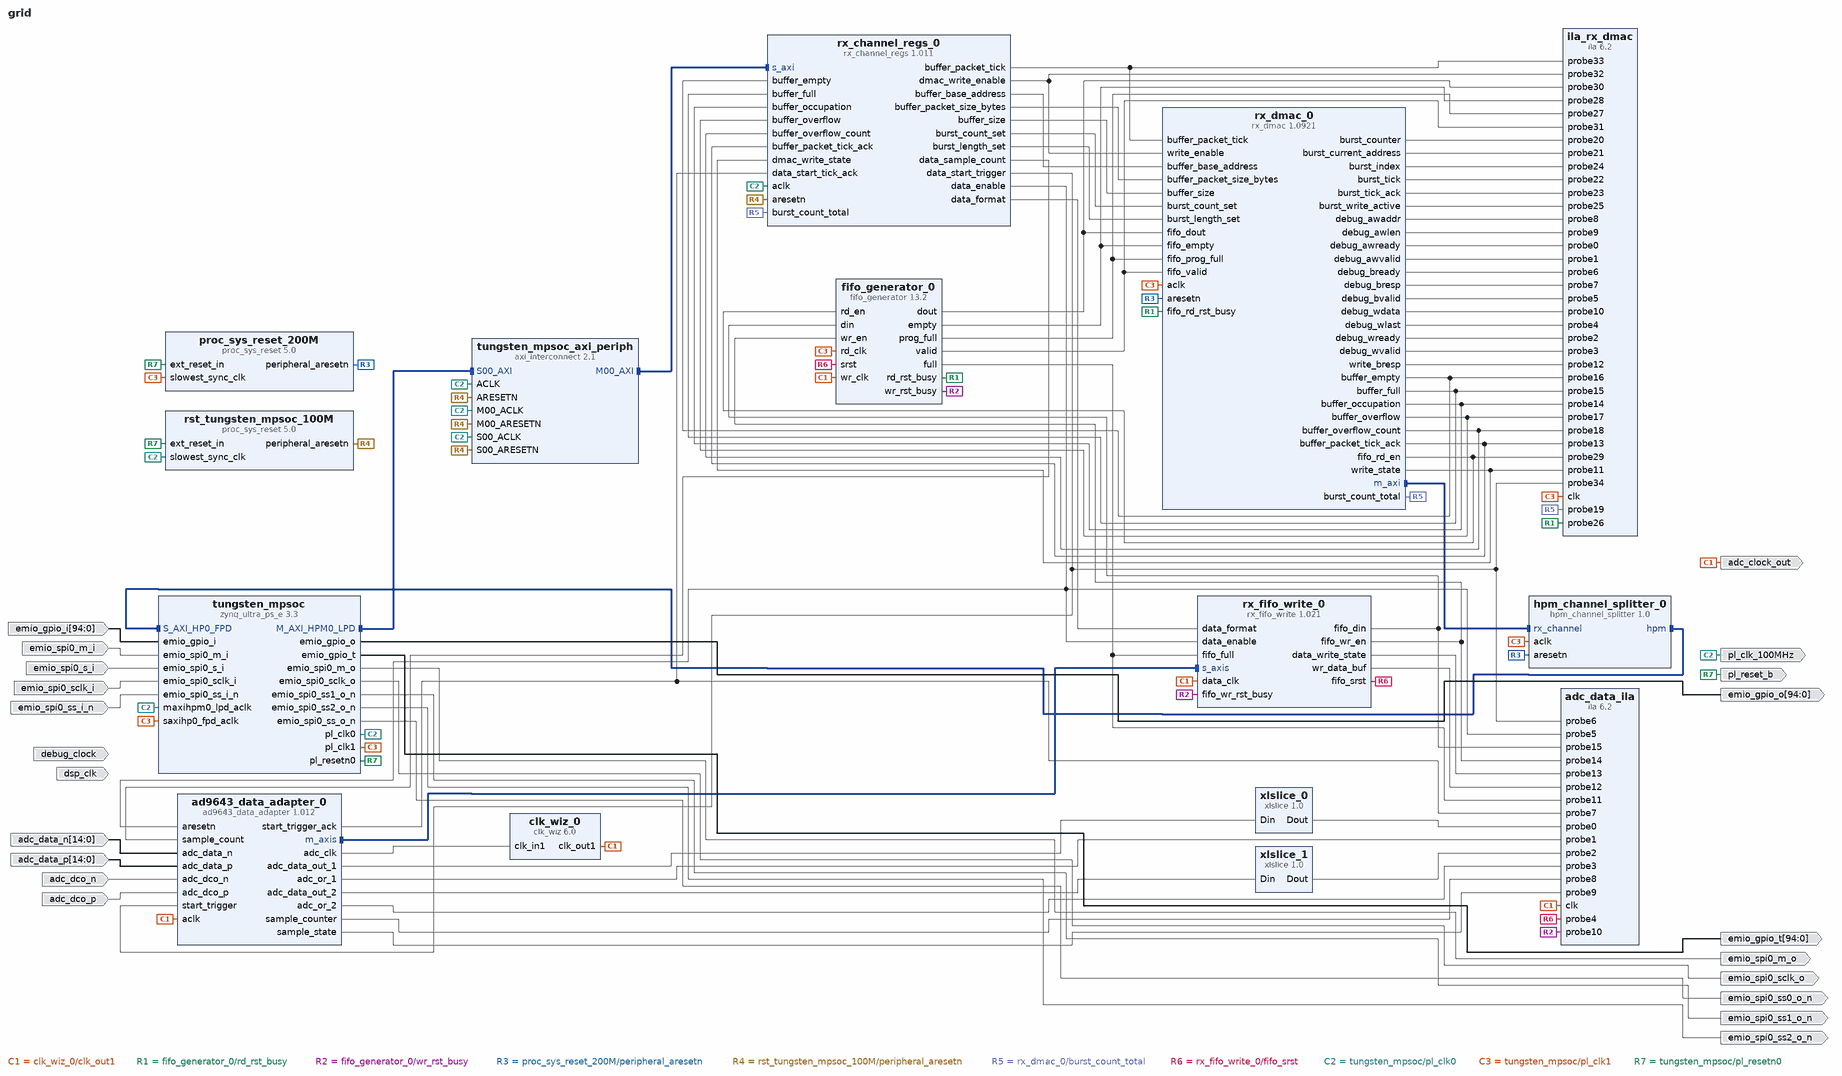
[diagram p0: block diagram of the top level]
# Vivado block design grid, xczu3cg-sfvc784-1-e, Vivado 2021.1.1
create_bd_design grid

create_bd_port -dir O -type rst pl_reset_b
create_bd_port -dir O -type clk pl_clk_100MHz
create_bd_port -dir O emio_spi0_sclk_o
create_bd_port -dir O emio_spi0_m_o
create_bd_port -dir I emio_spi0_m_i
create_bd_port -dir O emio_spi0_ss0_o_n
create_bd_port -dir O emio_spi0_ss1_o_n
create_bd_port -dir O emio_spi0_ss2_o_n
create_bd_port -dir I -from 94 -to 0 emio_gpio_i
create_bd_port -dir O -from 94 -to 0 emio_gpio_o
create_bd_port -dir O -from 94 -to 0 emio_gpio_t
create_bd_port -dir I debug_clock
create_bd_port -dir I emio_spi0_sclk_i
create_bd_port -dir I emio_spi0_ss_i_n
create_bd_port -dir I emio_spi0_s_i
create_bd_port -dir I -type clk dsp_clk
set_property -dict {CONFIG.FREQ_HZ 250000000} [get_bd_ports dsp_clk]
create_bd_port -dir I adc_dco_p
create_bd_port -dir I adc_dco_n
create_bd_port -dir I -from 14 -to 0 adc_data_p
create_bd_port -dir I -from 14 -to 0 adc_data_n
create_bd_port -dir O -type clk adc_clock_out

create_bd_cell -type ip -vlnv xilinx.com:ip:zynq_ultra_ps_e:3.3 tungsten_mpsoc
set_property -dict [list \
  CONFIG.CAN0_BOARD_INTERFACE custom \
  CONFIG.CAN1_BOARD_INTERFACE custom \
  CONFIG.CSU_BOARD_INTERFACE custom \
  CONFIG.DP_BOARD_INTERFACE custom \
  CONFIG.GEM0_BOARD_INTERFACE custom \
  CONFIG.GEM1_BOARD_INTERFACE custom \
  CONFIG.GEM2_BOARD_INTERFACE custom \
  CONFIG.GEM3_BOARD_INTERFACE custom \
  CONFIG.GPIO_BOARD_INTERFACE custom \
  CONFIG.IIC0_BOARD_INTERFACE custom \
  CONFIG.IIC1_BOARD_INTERFACE custom \
  CONFIG.NAND_BOARD_INTERFACE custom \
  CONFIG.PCIE_BOARD_INTERFACE custom \
  CONFIG.PJTAG_BOARD_INTERFACE custom \
  CONFIG.PMU_BOARD_INTERFACE custom \
  CONFIG.PSU_BANK_0_IO_STANDARD LVCMOS33 \
  CONFIG.PSU_BANK_1_IO_STANDARD LVCMOS33 \
  CONFIG.PSU_BANK_2_IO_STANDARD LVCMOS33 \
  CONFIG.PSU_BANK_3_IO_STANDARD LVCMOS33 \
  CONFIG.PSU_USB3__DUAL_CLOCK_ENABLE 1 \
  CONFIG.PSU__ACPU2__POWER__ON 0 \
  CONFIG.PSU__ACPU3__POWER__ON 0 \
  CONFIG.PSU__CAN1__PERIPHERAL__ENABLE 0 \
  CONFIG.PSU__CRF_APB__ACPU_CTRL__FREQMHZ 1200 \
  CONFIG.PSU__CRF_APB__ACPU_CTRL__SRCSEL APLL \
  CONFIG.PSU__CRF_APB__APLL_CTRL__SRCSEL PSS_REF_CLK \
  CONFIG.PSU__CRF_APB__DBG_FPD_CTRL__FREQMHZ 250 \
  CONFIG.PSU__CRF_APB__DBG_FPD_CTRL__SRCSEL IOPLL \
  CONFIG.PSU__CRF_APB__DBG_TRACE_CTRL__FREQMHZ 250 \
  CONFIG.PSU__CRF_APB__DBG_TRACE_CTRL__SRCSEL IOPLL \
  CONFIG.PSU__CRF_APB__DBG_TSTMP_CTRL__FREQMHZ 250 \
  CONFIG.PSU__CRF_APB__DBG_TSTMP_CTRL__SRCSEL IOPLL \
  CONFIG.PSU__CRF_APB__DDR_CTRL__FREQMHZ 1200 \
  CONFIG.PSU__CRF_APB__DDR_CTRL__SRCSEL DPLL \
  CONFIG.PSU__CRF_APB__DPDMA_REF_CTRL__FREQMHZ 600 \
  CONFIG.PSU__CRF_APB__DPDMA_REF_CTRL__SRCSEL DPLL \
  CONFIG.PSU__CRF_APB__DPLL_CTRL__SRCSEL PSS_REF_CLK \
  CONFIG.PSU__CRF_APB__DP_AUDIO_REF_CTRL__SRCSEL VPLL \
  CONFIG.PSU__CRF_APB__DP_STC_REF_CTRL__SRCSEL VPLL \
  CONFIG.PSU__CRF_APB__DP_VIDEO_REF_CTRL__SRCSEL DPLL \
  CONFIG.PSU__CRF_APB__GDMA_REF_CTRL__FREQMHZ 600 \
  CONFIG.PSU__CRF_APB__GDMA_REF_CTRL__SRCSEL DPLL \
  CONFIG.PSU__CRF_APB__GPU_REF_CTRL__FREQMHZ 600 \
  CONFIG.PSU__CRF_APB__GPU_REF_CTRL__SRCSEL DPLL \
  CONFIG.PSU__CRF_APB__TOPSW_LSBUS_CTRL__FREQMHZ 100 \
  CONFIG.PSU__CRF_APB__TOPSW_LSBUS_CTRL__SRCSEL IOPLL \
  CONFIG.PSU__CRF_APB__TOPSW_MAIN_CTRL__FREQMHZ 533.333 \
  CONFIG.PSU__CRF_APB__TOPSW_MAIN_CTRL__SRCSEL VPLL \
  CONFIG.PSU__CRF_APB__VPLL_CTRL__SRCSEL PSS_REF_CLK \
  CONFIG.PSU__CRL_APB__ADMA_REF_CTRL__FREQMHZ 500 \
  CONFIG.PSU__CRL_APB__ADMA_REF_CTRL__SRCSEL IOPLL \
  CONFIG.PSU__CRL_APB__CAN1_REF_CTRL__FREQMHZ 100 \
  CONFIG.PSU__CRL_APB__CAN1_REF_CTRL__SRCSEL IOPLL \
  CONFIG.PSU__CRL_APB__CPU_R5_CTRL__FREQMHZ 500 \
  CONFIG.PSU__CRL_APB__CPU_R5_CTRL__SRCSEL IOPLL \
  CONFIG.PSU__CRL_APB__DBG_LPD_CTRL__FREQMHZ 250 \
  CONFIG.PSU__CRL_APB__DBG_LPD_CTRL__SRCSEL IOPLL \
  CONFIG.PSU__CRL_APB__GEM3_REF_CTRL__FREQMHZ 125 \
  CONFIG.PSU__CRL_APB__GEM3_REF_CTRL__SRCSEL IOPLL \
  CONFIG.PSU__CRL_APB__I2C0_REF_CTRL__FREQMHZ 100 \
  CONFIG.PSU__CRL_APB__I2C0_REF_CTRL__SRCSEL IOPLL \
  CONFIG.PSU__CRL_APB__I2C1_REF_CTRL__FREQMHZ 100 \
  CONFIG.PSU__CRL_APB__I2C1_REF_CTRL__SRCSEL IOPLL \
  CONFIG.PSU__CRL_APB__IOPLL_CTRL__SRCSEL PSS_REF_CLK \
  CONFIG.PSU__CRL_APB__IOU_SWITCH_CTRL__FREQMHZ 267 \
  CONFIG.PSU__CRL_APB__IOU_SWITCH_CTRL__SRCSEL RPLL \
  CONFIG.PSU__CRL_APB__LPD_LSBUS_CTRL__FREQMHZ 100 \
  CONFIG.PSU__CRL_APB__LPD_LSBUS_CTRL__SRCSEL IOPLL \
  CONFIG.PSU__CRL_APB__LPD_SWITCH_CTRL__FREQMHZ 500 \
  CONFIG.PSU__CRL_APB__LPD_SWITCH_CTRL__SRCSEL IOPLL \
  CONFIG.PSU__CRL_APB__PCAP_CTRL__FREQMHZ 200 \
  CONFIG.PSU__CRL_APB__PCAP_CTRL__SRCSEL IOPLL \
  CONFIG.PSU__CRL_APB__PL0_REF_CTRL__FREQMHZ 100 \
  CONFIG.PSU__CRL_APB__PL0_REF_CTRL__SRCSEL RPLL \
  CONFIG.PSU__CRL_APB__PL1_REF_CTRL__FREQMHZ 200 \
  CONFIG.PSU__CRL_APB__PL1_REF_CTRL__SRCSEL DPLL \
  CONFIG.PSU__CRL_APB__QSPI_REF_CTRL__FREQMHZ 300 \
  CONFIG.PSU__CRL_APB__QSPI_REF_CTRL__SRCSEL IOPLL \
  CONFIG.PSU__CRL_APB__RPLL_CTRL__SRCSEL PSS_REF_CLK \
  CONFIG.PSU__CRL_APB__SDIO1_REF_CTRL__FREQMHZ 200 \
  CONFIG.PSU__CRL_APB__SDIO1_REF_CTRL__SRCSEL RPLL \
  CONFIG.PSU__CRL_APB__SPI0_REF_CTRL__FREQMHZ 150 \
  CONFIG.PSU__CRL_APB__SPI0_REF_CTRL__SRCSEL IOPLL \
  CONFIG.PSU__CRL_APB__SPI1_REF_CTRL__FREQMHZ 150 \
  CONFIG.PSU__CRL_APB__SPI1_REF_CTRL__SRCSEL IOPLL \
  CONFIG.PSU__CRL_APB__TIMESTAMP_REF_CTRL__FREQMHZ 100 \
  CONFIG.PSU__CRL_APB__TIMESTAMP_REF_CTRL__SRCSEL PSS_REF_CLK \
  CONFIG.PSU__CRL_APB__UART0_REF_CTRL__FREQMHZ 100 \
  CONFIG.PSU__CRL_APB__UART0_REF_CTRL__SRCSEL IOPLL \
  CONFIG.PSU__CRL_APB__UART1_REF_CTRL__FREQMHZ 100 \
  CONFIG.PSU__CRL_APB__UART1_REF_CTRL__SRCSEL IOPLL \
  CONFIG.PSU__CRL_APB__USB0_BUS_REF_CTRL__FREQMHZ 250 \
  CONFIG.PSU__CRL_APB__USB0_BUS_REF_CTRL__SRCSEL IOPLL \
  CONFIG.PSU__CRL_APB__USB3_DUAL_REF_CTRL__FREQMHZ 20 \
  CONFIG.PSU__CRL_APB__USB3_DUAL_REF_CTRL__SRCSEL IOPLL \
  CONFIG.PSU__CRL_APB__USB3__ENABLE 1 \
  CONFIG.PSU__CSUPMU__PERIPHERAL__VALID 0 \
  CONFIG.PSU__DDRC__BUS_WIDTH {64 Bit} \
  CONFIG.PSU__DDRC__COMPONENTS Components \
  CONFIG.PSU__DDRC__DEVICE_CAPACITY {8192 MBits} \
  CONFIG.PSU__DDRC__DRAM_WIDTH {16 Bits} \
  CONFIG.PSU__DDRC__ECC Disabled \
  CONFIG.PSU__DDRC__MEMORY_TYPE {DDR 4} \
  CONFIG.PSU__DDRC__SPEED_BIN DDR4_2400T \
  CONFIG.PSU__DDR_HIGH_ADDRESS_GUI_ENABLE 1 \
  CONFIG.PSU__DDR__INTERFACE__FREQMHZ 600.000 \
  CONFIG.PSU__DEVICE_TYPE CG \
  CONFIG.PSU__DISPLAYPORT__PERIPHERAL__ENABLE 0 \
  CONFIG.PSU__DLL__ISUSED 1 \
  CONFIG.PSU__ENET1__GRP_MDIO__ENABLE 1 \
  CONFIG.PSU__ENET1__GRP_MDIO__IO {MIO 50 .. 51} \
  CONFIG.PSU__ENET1__PERIPHERAL__ENABLE 1 \
  CONFIG.PSU__ENET1__PERIPHERAL__IO {GT Lane1} \
  CONFIG.PSU__ENET3__PERIPHERAL__ENABLE 0 \
  CONFIG.PSU__FPD_SLCR__WDT1__FREQMHZ 100 \
  CONFIG.PSU__FPGA_PL0_ENABLE 1 \
  CONFIG.PSU__FPGA_PL1_ENABLE 1 \
  CONFIG.PSU__GEM1__REF_CLK_FREQ 125 \
  CONFIG.PSU__GEM1__REF_CLK_SEL {Ref Clk1} \
  CONFIG.PSU__GEM__TSU__ENABLE 0 \
  CONFIG.PSU__GPIO0_MIO__IO {MIO 0 .. 25} \
  CONFIG.PSU__GPIO0_MIO__PERIPHERAL__ENABLE 1 \
  CONFIG.PSU__GPIO1_MIO__IO {MIO 26 .. 51} \
  CONFIG.PSU__GPIO1_MIO__PERIPHERAL__ENABLE 1 \
  CONFIG.PSU__GPIO_EMIO_WIDTH 95 \
  CONFIG.PSU__GPIO_EMIO__PERIPHERAL__ENABLE 1 \
  CONFIG.PSU__GPIO_EMIO__PERIPHERAL__IO 95 \
  CONFIG.PSU__GPU_PP0__POWER__ON 0 \
  CONFIG.PSU__GPU_PP1__POWER__ON 0 \
  CONFIG.PSU__I2C0__PERIPHERAL__ENABLE 1 \
  CONFIG.PSU__I2C0__PERIPHERAL__IO {MIO 6 .. 7} \
  CONFIG.PSU__I2C1__PERIPHERAL__ENABLE 1 \
  CONFIG.PSU__I2C1__PERIPHERAL__IO {MIO 44 .. 45} \
  CONFIG.PSU__IOU_SLCR__IOU_TTC_APB_CLK__TTC0_SEL APB \
  CONFIG.PSU__IOU_SLCR__IOU_TTC_APB_CLK__TTC1_SEL APB \
  CONFIG.PSU__IOU_SLCR__IOU_TTC_APB_CLK__TTC2_SEL APB \
  CONFIG.PSU__IOU_SLCR__IOU_TTC_APB_CLK__TTC3_SEL APB \
  CONFIG.PSU__IOU_SLCR__WDT0__FREQMHZ 100 \
  CONFIG.PSU__LPD_SLCR__CSUPMU__FREQMHZ 100 \
  CONFIG.PSU__OVERRIDE_HPX_QOS 0 \
  CONFIG.PSU__OVERRIDE__BASIC_CLOCK 0 \
  CONFIG.PSU__PJTAG__PERIPHERAL__ENABLE 1 \
  CONFIG.PSU__PJTAG__PERIPHERAL__IO {MIO 26 .. 29} \
  CONFIG.PSU__PMU__PERIPHERAL__ENABLE 0 \
  CONFIG.PSU__PRESET_APPLIED 0 \
  CONFIG.PSU__PSS_REF_CLK__FREQMHZ 50 \
  CONFIG.PSU__QSPI_COHERENCY 0 \
  CONFIG.PSU__QSPI_ROUTE_THROUGH_FPD 0 \
  CONFIG.PSU__QSPI__GRP_FBCLK__ENABLE 0 \
  CONFIG.PSU__QSPI__PERIPHERAL__DATA_MODE x4 \
  CONFIG.PSU__QSPI__PERIPHERAL__ENABLE 1 \
  CONFIG.PSU__QSPI__PERIPHERAL__IO {MIO 0 .. 5} \
  CONFIG.PSU__QSPI__PERIPHERAL__MODE Single \
  CONFIG.PSU__SATA__PERIPHERAL__ENABLE 0 \
  CONFIG.PSU__SD0__DATA_TRANSFER_MODE 4Bit \
  CONFIG.PSU__SD0__GRP_CD__ENABLE 1 \
  CONFIG.PSU__SD0__GRP_CD__IO {MIO 24} \
  CONFIG.PSU__SD0__PERIPHERAL__ENABLE 1 \
  CONFIG.PSU__SD0__PERIPHERAL__IO {MIO 13 .. 16 21 22} \
  CONFIG.PSU__SD0__SLOT_TYPE {SD 2.0} \
  CONFIG.PSU__SD1__PERIPHERAL__ENABLE 0 \
  CONFIG.PSU__SPI0__GRP_SS0__IO EMIO \
  CONFIG.PSU__SPI0__GRP_SS1__ENABLE 1 \
  CONFIG.PSU__SPI0__GRP_SS1__IO EMIO \
  CONFIG.PSU__SPI0__GRP_SS2__ENABLE 1 \
  CONFIG.PSU__SPI0__GRP_SS2__IO EMIO \
  CONFIG.PSU__SPI0__PERIPHERAL__ENABLE 1 \
  CONFIG.PSU__SPI0__PERIPHERAL__IO EMIO \
  CONFIG.PSU__SPI1__GRP_SS0__IO {MIO 35} \
  CONFIG.PSU__SPI1__GRP_SS1__ENABLE 1 \
  CONFIG.PSU__SPI1__GRP_SS1__IO {MIO 34} \
  CONFIG.PSU__SPI1__GRP_SS2__ENABLE 1 \
  CONFIG.PSU__SPI1__GRP_SS2__IO {MIO 33} \
  CONFIG.PSU__SPI1__PERIPHERAL__ENABLE 1 \
  CONFIG.PSU__SPI1__PERIPHERAL__IO {MIO 32 .. 37} \
  CONFIG.PSU__SWDT0__PERIPHERAL__ENABLE 0 \
  CONFIG.PSU__SWDT1__PERIPHERAL__ENABLE 0 \
  CONFIG.PSU__TRACE__INTERNAL_WIDTH 4 \
  CONFIG.PSU__TRACE__PERIPHERAL__ENABLE 1 \
  CONFIG.PSU__TRACE__PERIPHERAL__IO {MIO 26 .. 43} \
  CONFIG.PSU__TRACE__WIDTH 4Bit \
  CONFIG.PSU__TSU__BUFG_PORT_PAIR 0 \
  CONFIG.PSU__TTC0__CLOCK__ENABLE 0 \
  CONFIG.PSU__TTC0__PERIPHERAL__ENABLE 1 \
  CONFIG.PSU__TTC0__WAVEOUT__ENABLE 0 \
  CONFIG.PSU__TTC1__CLOCK__ENABLE 0 \
  CONFIG.PSU__TTC1__PERIPHERAL__ENABLE 1 \
  CONFIG.PSU__TTC1__WAVEOUT__ENABLE 0 \
  CONFIG.PSU__TTC2__CLOCK__ENABLE 0 \
  CONFIG.PSU__TTC2__PERIPHERAL__ENABLE 1 \
  CONFIG.PSU__TTC2__WAVEOUT__ENABLE 0 \
  CONFIG.PSU__TTC3__CLOCK__ENABLE 0 \
  CONFIG.PSU__TTC3__PERIPHERAL__ENABLE 1 \
  CONFIG.PSU__TTC3__WAVEOUT__ENABLE 0 \
  CONFIG.PSU__UART0__BAUD_RATE 115200 \
  CONFIG.PSU__UART0__MODEM__ENABLE 0 \
  CONFIG.PSU__UART0__PERIPHERAL__ENABLE 1 \
  CONFIG.PSU__UART0__PERIPHERAL__IO {MIO 30 .. 31} \
  CONFIG.PSU__UART1__PERIPHERAL__ENABLE 0 \
  CONFIG.PSU__USB0_COHERENCY 0 \
  CONFIG.PSU__USB0__PERIPHERAL__ENABLE 1 \
  CONFIG.PSU__USB0__PERIPHERAL__IO {MIO 52 .. 63} \
  CONFIG.PSU__USB0__REF_CLK_FREQ 26 \
  CONFIG.PSU__USB0__REF_CLK_SEL {Ref Clk3} \
  CONFIG.PSU__USB0__RESET__ENABLE 1 \
  CONFIG.PSU__USB0__RESET__IO {MIO 77} \
  CONFIG.PSU__USB1__PERIPHERAL__ENABLE 1 \
  CONFIG.PSU__USB1__PERIPHERAL__IO {MIO 64 .. 75} \
  CONFIG.PSU__USB1__REF_CLK_FREQ 26 \
  CONFIG.PSU__USB1__REF_CLK_SEL {Ref Clk3} \
  CONFIG.PSU__USB1__RESET__ENABLE 1 \
  CONFIG.PSU__USB1__RESET__IO {MIO 76} \
  CONFIG.PSU__USB2_0__EMIO__ENABLE 0 \
  CONFIG.PSU__USB3_0__EMIO__ENABLE 0 \
  CONFIG.PSU__USB3_0__PERIPHERAL__ENABLE 1 \
  CONFIG.PSU__USB3_0__PERIPHERAL__IO {GT Lane2} \
  CONFIG.PSU__USB3_1__PERIPHERAL__ENABLE 1 \
  CONFIG.PSU__USB3_1__PERIPHERAL__IO {GT Lane3} \
  CONFIG.PSU__USB__RESET__MODE {Separate MIO Pin} \
  CONFIG.PSU__USB__RESET__POLARITY {Active Low} \
  CONFIG.PSU__USE__IRQ0 0 \
  CONFIG.PSU__USE__M_AXI_GP0 0 \
  CONFIG.PSU__USE__M_AXI_GP1 0 \
  CONFIG.PSU__USE__M_AXI_GP2 1 \
  CONFIG.PSU__USE__S_AXI_GP2 1 \
  CONFIG.QSPI_BOARD_INTERFACE custom \
  CONFIG.SATA_BOARD_INTERFACE custom \
  CONFIG.SD0_BOARD_INTERFACE custom \
  CONFIG.SD1_BOARD_INTERFACE custom \
  CONFIG.SPI0_BOARD_INTERFACE custom \
  CONFIG.SPI1_BOARD_INTERFACE custom \
  CONFIG.SUBPRESET1 Custom \
  CONFIG.SUBPRESET2 Custom \
  CONFIG.SWDT0_BOARD_INTERFACE custom \
  CONFIG.SWDT1_BOARD_INTERFACE custom \
  CONFIG.TRACE_BOARD_INTERFACE custom \
  CONFIG.TTC0_BOARD_INTERFACE custom \
  CONFIG.TTC1_BOARD_INTERFACE custom \
  CONFIG.TTC2_BOARD_INTERFACE custom \
  CONFIG.TTC3_BOARD_INTERFACE custom \
  CONFIG.UART0_BOARD_INTERFACE custom \
  CONFIG.UART1_BOARD_INTERFACE custom \
  CONFIG.USB0_BOARD_INTERFACE custom \
  CONFIG.USB1_BOARD_INTERFACE custom \
  CONFIG.preset None \
] [get_bd_cells tungsten_mpsoc]
# 738 more settings of tungsten_mpsoc are not shown: defaults, MIO pin electricals, DDR timing, and values the tool derives
create_bd_cell -type ip -vlnv xilinx.com:ip:axi_interconnect:2.1 tungsten_mpsoc_axi_periph
set_property -dict {CONFIG.NUM_MI 1} [get_bd_cells tungsten_mpsoc_axi_periph]
create_bd_cell -type ip -vlnv xilinx.com:ip:proc_sys_reset:5.0 rst_tungsten_mpsoc_100M
create_bd_cell -type ip -vlnv xilinx.com:ip:ila:6.2 adc_data_ila
set_property -dict [list \
  CONFIG.C_ENABLE_ILA_AXI_MON false \
  CONFIG.C_MONITOR_TYPE Native \
  CONFIG.C_NUM_OF_PROBES 16 \
  CONFIG.C_PROBE0_WIDTH 14 \
  CONFIG.C_PROBE2_WIDTH 14 \
] [get_bd_cells adc_data_ila]
create_bd_cell -type ip -vlnv xilinx.com:ip:fifo_generator:13.2 fifo_generator_0
set_property -dict [list \
  CONFIG.Fifo_Implementation Independent_Clocks_Builtin_FIFO \
  CONFIG.Full_Threshold_Assert_Value 256 \
  CONFIG.Input_Data_Width 128 \
  CONFIG.Input_Depth 512 \
  CONFIG.Programmable_Full_Type Single_Programmable_Full_Threshold_Constant \
  CONFIG.Read_Clock_Frequency 200 \
  CONFIG.Valid_Flag true \
  CONFIG.Write_Clock_Frequency 250 \
] [get_bd_cells fifo_generator_0]
create_bd_cell -type ip -vlnv tidalloft.com:user:hpm_channel_splitter:1.0 hpm_channel_splitter_0
create_bd_cell -type ip -vlnv xilinx.com:ip:ila:6.2 ila_rx_dmac
set_property -dict [list \
  CONFIG.C_DATA_DEPTH 2048 \
  CONFIG.C_ENABLE_ILA_AXI_MON false \
  CONFIG.C_MONITOR_TYPE Native \
  CONFIG.C_NUM_OF_PROBES 35 \
] [get_bd_cells ila_rx_dmac]
create_bd_cell -type ip -vlnv xilinx.com:ip:proc_sys_reset:5.0 proc_sys_reset_200M
create_bd_cell -type ip -vlnv xilinx.com:ip:xlslice:1.0 xlslice_0
set_property -dict {CONFIG.DIN_FROM 13 CONFIG.DIN_WIDTH 15 CONFIG.DOUT_WIDTH 14} [get_bd_cells xlslice_0]
create_bd_cell -type ip -vlnv xilinx.com:ip:xlslice:1.0 xlslice_1
set_property -dict {CONFIG.DIN_FROM 13 CONFIG.DIN_WIDTH 15 CONFIG.DOUT_WIDTH 14} [get_bd_cells xlslice_1]
create_bd_cell -type ip -vlnv xilinx.com:ip:clk_wiz:6.0 clk_wiz_0
set_property -dict [list \
  CONFIG.CLKIN1_JITTER_PS 40.0 \
  CONFIG.CLKOUT1_DRIVES Buffer \
  CONFIG.CLKOUT1_JITTER 85.152 \
  CONFIG.CLKOUT1_PHASE_ERROR 78.266 \
  CONFIG.CLKOUT1_REQUESTED_OUT_FREQ 250 \
  CONFIG.CLKOUT1_REQUESTED_PHASE 180 \
  CONFIG.CLKOUT2_DRIVES Buffer \
  CONFIG.CLKOUT3_DRIVES Buffer \
  CONFIG.CLKOUT4_DRIVES Buffer \
  CONFIG.CLKOUT5_DRIVES Buffer \
  CONFIG.CLKOUT6_DRIVES Buffer \
  CONFIG.CLKOUT7_DRIVES Buffer \
  CONFIG.MMCM_CLKFBOUT_MULT_F 4.750 \
  CONFIG.MMCM_CLKIN1_PERIOD 4.000 \
  CONFIG.MMCM_CLKIN2_PERIOD 10.0 \
  CONFIG.MMCM_CLKOUT0_DIVIDE_F 4.750 \
  CONFIG.MMCM_CLKOUT0_PHASE 180.000 \
  CONFIG.MMCM_DIVCLK_DIVIDE 1 \
  CONFIG.PRIM_IN_FREQ 250 \
  CONFIG.SECONDARY_SOURCE Single_ended_clock_capable_pin \
  CONFIG.USE_LOCKED false \
  CONFIG.USE_PHASE_ALIGNMENT true \
  CONFIG.USE_RESET false \
] [get_bd_cells clk_wiz_0]
create_bd_cell -type ip -vlnv tidalloft.com:user:rx_fifo_write:1.021 rx_fifo_write_0
create_bd_cell -type ip -vlnv tidalloft.com:user:ad9643_data_adapter:1.012 ad9643_data_adapter_0
create_bd_cell -type ip -vlnv tidalloft.com:user:rx_dmac:1.0921 rx_dmac_0
create_bd_cell -type ip -vlnv tidalloft.com:user:rx_channel_regs:1.011 rx_channel_regs_0

# ---- connections ----

connect_bd_intf_net [get_bd_intf_pins ad9643_data_adapter_0/m_axis] [get_bd_intf_pins rx_fifo_write_0/s_axis]
connect_bd_intf_net [get_bd_intf_pins hpm_channel_splitter_0/hpm] [get_bd_intf_pins tungsten_mpsoc/S_AXI_HP0_FPD]
connect_bd_intf_net [get_bd_intf_pins hpm_channel_splitter_0/rx_channel] [get_bd_intf_pins rx_dmac_0/m_axi]
connect_bd_intf_net [get_bd_intf_pins tungsten_mpsoc/M_AXI_HPM0_LPD] [get_bd_intf_pins tungsten_mpsoc_axi_periph/S00_AXI]
connect_bd_intf_net [get_bd_intf_pins tungsten_mpsoc_axi_periph/M00_AXI] [get_bd_intf_pins rx_channel_regs_0/s_axi]
connect_bd_net [get_bd_pins rx_channel_regs_0/data_enable] \
  [get_bd_pins adc_data_ila/probe5] [get_bd_pins rx_fifo_write_0/data_enable] [get_bd_pins ad9643_data_adapter_0/aresetn]
connect_bd_net [get_bd_pins ad9643_data_adapter_0/adc_clk] [get_bd_pins clk_wiz_0/clk_in1]
connect_bd_net [get_bd_pins ad9643_data_adapter_0/adc_data_out_1] [get_bd_pins xlslice_0/Din]
connect_bd_net [get_bd_pins ad9643_data_adapter_0/adc_data_out_2] [get_bd_pins xlslice_1/Din]
connect_bd_net [get_bd_pins ad9643_data_adapter_0/adc_or_1] [get_bd_pins adc_data_ila/probe1]
connect_bd_net [get_bd_pins ad9643_data_adapter_0/adc_or_2] [get_bd_pins adc_data_ila/probe3]
connect_bd_net [get_bd_pins ad9643_data_adapter_0/sample_counter] [get_bd_pins adc_data_ila/probe8]
connect_bd_net [get_bd_pins ad9643_data_adapter_0/sample_state] [get_bd_pins adc_data_ila/probe9]
connect_bd_net [get_bd_pins ad9643_data_adapter_0/start_trigger_ack] \
  [get_bd_pins adc_data_ila/probe7] [get_bd_pins rx_channel_regs_0/data_start_tick_ack]
connect_bd_net -net adc_clk [get_bd_pins clk_wiz_0/clk_out1] \
  [get_bd_pins adc_data_ila/clk] [get_bd_pins fifo_generator_0/wr_clk] [get_bd_ports adc_clock_out] \
  [get_bd_pins rx_fifo_write_0/data_clk] [get_bd_pins ad9643_data_adapter_0/aclk]
connect_bd_net [get_bd_ports adc_data_n] [get_bd_pins ad9643_data_adapter_0/adc_data_n]
connect_bd_net [get_bd_ports adc_data_p] [get_bd_pins ad9643_data_adapter_0/adc_data_p]
connect_bd_net [get_bd_ports adc_dco_n] [get_bd_pins ad9643_data_adapter_0/adc_dco_n]
connect_bd_net [get_bd_ports adc_dco_p] [get_bd_pins ad9643_data_adapter_0/adc_dco_p]
connect_bd_net [get_bd_ports emio_gpio_i] [get_bd_pins tungsten_mpsoc/emio_gpio_i]
connect_bd_net [get_bd_ports emio_spi0_m_i] [get_bd_pins tungsten_mpsoc/emio_spi0_m_i]
connect_bd_net [get_bd_ports emio_spi0_s_i] [get_bd_pins tungsten_mpsoc/emio_spi0_s_i]
connect_bd_net [get_bd_ports emio_spi0_sclk_i] [get_bd_pins tungsten_mpsoc/emio_spi0_sclk_i]
connect_bd_net [get_bd_ports emio_spi0_ss_i_n] [get_bd_pins tungsten_mpsoc/emio_spi0_ss_i_n]
connect_bd_net [get_bd_pins fifo_generator_0/dout] [get_bd_pins ila_rx_dmac/probe30] [get_bd_pins rx_dmac_0/fifo_dout]
connect_bd_net [get_bd_pins fifo_generator_0/empty] [get_bd_pins ila_rx_dmac/probe28] [get_bd_pins rx_dmac_0/fifo_empty]
connect_bd_net [get_bd_pins fifo_generator_0/full] [get_bd_pins adc_data_ila/probe11] [get_bd_pins rx_fifo_write_0/fifo_full]
connect_bd_net [get_bd_pins fifo_generator_0/prog_full] [get_bd_pins ila_rx_dmac/probe27] [get_bd_pins rx_dmac_0/fifo_prog_full]
connect_bd_net [get_bd_pins fifo_generator_0/rd_rst_busy] [get_bd_pins ila_rx_dmac/probe26] [get_bd_pins rx_dmac_0/fifo_rd_rst_busy]
connect_bd_net [get_bd_pins fifo_generator_0/valid] [get_bd_pins ila_rx_dmac/probe31] [get_bd_pins rx_dmac_0/fifo_valid]
connect_bd_net [get_bd_pins fifo_generator_0/wr_rst_busy] [get_bd_pins adc_data_ila/probe10] [get_bd_pins rx_fifo_write_0/fifo_wr_rst_busy]
connect_bd_net [get_bd_pins proc_sys_reset_200M/peripheral_aresetn] [get_bd_pins hpm_channel_splitter_0/aresetn] [get_bd_pins rx_dmac_0/aresetn]
connect_bd_net [get_bd_pins rst_tungsten_mpsoc_100M/peripheral_aresetn] \
  [get_bd_pins tungsten_mpsoc_axi_periph/S00_ARESETN] [get_bd_pins tungsten_mpsoc_axi_periph/M00_ARESETN] \
  [get_bd_pins tungsten_mpsoc_axi_periph/ARESETN] [get_bd_pins rx_channel_regs_0/aresetn]
connect_bd_net [get_bd_pins rx_channel_regs_0/buffer_base_address] [get_bd_pins rx_dmac_0/buffer_base_address]
connect_bd_net [get_bd_pins rx_channel_regs_0/buffer_packet_size_bytes] [get_bd_pins rx_dmac_0/buffer_packet_size_bytes]
connect_bd_net [get_bd_pins rx_channel_regs_0/buffer_packet_tick] [get_bd_pins ila_rx_dmac/probe33] [get_bd_pins rx_dmac_0/buffer_packet_tick]
connect_bd_net [get_bd_pins rx_channel_regs_0/buffer_size] [get_bd_pins rx_dmac_0/buffer_size]
connect_bd_net [get_bd_pins rx_channel_regs_0/burst_count_set] [get_bd_pins rx_dmac_0/burst_count_set]
connect_bd_net [get_bd_pins rx_channel_regs_0/burst_length_set] [get_bd_pins rx_dmac_0/burst_length_set]
connect_bd_net [get_bd_pins rx_channel_regs_0/data_format] [get_bd_pins rx_fifo_write_0/data_format]
connect_bd_net [get_bd_pins rx_channel_regs_0/data_sample_count] [get_bd_pins ad9643_data_adapter_0/sample_count]
connect_bd_net [get_bd_pins rx_channel_regs_0/data_start_trigger] \
  [get_bd_pins adc_data_ila/probe6] [get_bd_pins ila_rx_dmac/probe34] [get_bd_pins ad9643_data_adapter_0/start_trigger]
connect_bd_net [get_bd_pins rx_channel_regs_0/dmac_write_enable] [get_bd_pins ila_rx_dmac/probe32] [get_bd_pins rx_dmac_0/write_enable]
connect_bd_net [get_bd_pins rx_dmac_0/buffer_empty] [get_bd_pins ila_rx_dmac/probe16] [get_bd_pins rx_channel_regs_0/buffer_empty]
connect_bd_net [get_bd_pins rx_dmac_0/buffer_full] [get_bd_pins ila_rx_dmac/probe15] [get_bd_pins rx_channel_regs_0/buffer_full]
connect_bd_net [get_bd_pins rx_dmac_0/buffer_occupation] [get_bd_pins ila_rx_dmac/probe14] [get_bd_pins rx_channel_regs_0/buffer_occupation]
connect_bd_net [get_bd_pins rx_dmac_0/buffer_overflow] [get_bd_pins ila_rx_dmac/probe17] [get_bd_pins rx_channel_regs_0/buffer_overflow]
connect_bd_net [get_bd_pins rx_dmac_0/buffer_overflow_count] [get_bd_pins ila_rx_dmac/probe18] [get_bd_pins rx_channel_regs_0/buffer_overflow_count]
connect_bd_net [get_bd_pins rx_dmac_0/buffer_packet_tick_ack] [get_bd_pins ila_rx_dmac/probe13] [get_bd_pins rx_channel_regs_0/buffer_packet_tick_ack]
connect_bd_net [get_bd_pins rx_dmac_0/burst_count_total] [get_bd_pins ila_rx_dmac/probe19] [get_bd_pins rx_channel_regs_0/burst_count_total]
connect_bd_net [get_bd_pins rx_dmac_0/burst_counter] [get_bd_pins ila_rx_dmac/probe20]
connect_bd_net [get_bd_pins rx_dmac_0/burst_current_address] [get_bd_pins ila_rx_dmac/probe21]
connect_bd_net [get_bd_pins rx_dmac_0/burst_index] [get_bd_pins ila_rx_dmac/probe24]
connect_bd_net [get_bd_pins rx_dmac_0/burst_tick] [get_bd_pins ila_rx_dmac/probe22]
connect_bd_net [get_bd_pins rx_dmac_0/burst_tick_ack] [get_bd_pins ila_rx_dmac/probe23]
connect_bd_net [get_bd_pins rx_dmac_0/burst_write_active] [get_bd_pins ila_rx_dmac/probe25]
connect_bd_net [get_bd_pins rx_dmac_0/debug_awaddr] [get_bd_pins ila_rx_dmac/probe8]
connect_bd_net [get_bd_pins rx_dmac_0/debug_awlen] [get_bd_pins ila_rx_dmac/probe9]
connect_bd_net [get_bd_pins rx_dmac_0/debug_awready] [get_bd_pins ila_rx_dmac/probe0]
connect_bd_net [get_bd_pins rx_dmac_0/debug_awvalid] [get_bd_pins ila_rx_dmac/probe1]
connect_bd_net [get_bd_pins rx_dmac_0/debug_bready] [get_bd_pins ila_rx_dmac/probe6]
connect_bd_net [get_bd_pins rx_dmac_0/debug_bresp] [get_bd_pins ila_rx_dmac/probe7]
connect_bd_net [get_bd_pins rx_dmac_0/debug_bvalid] [get_bd_pins ila_rx_dmac/probe5]
connect_bd_net [get_bd_pins rx_dmac_0/debug_wdata] [get_bd_pins ila_rx_dmac/probe10]
connect_bd_net [get_bd_pins rx_dmac_0/debug_wlast] [get_bd_pins ila_rx_dmac/probe4]
connect_bd_net [get_bd_pins rx_dmac_0/debug_wready] [get_bd_pins ila_rx_dmac/probe2]
connect_bd_net [get_bd_pins rx_dmac_0/debug_wvalid] [get_bd_pins ila_rx_dmac/probe3]
connect_bd_net [get_bd_pins rx_dmac_0/fifo_rd_en] [get_bd_pins fifo_generator_0/rd_en] [get_bd_pins ila_rx_dmac/probe29]
connect_bd_net [get_bd_pins rx_dmac_0/write_bresp] [get_bd_pins ila_rx_dmac/probe12]
connect_bd_net [get_bd_pins rx_dmac_0/write_state] [get_bd_pins ila_rx_dmac/probe11] [get_bd_pins rx_channel_regs_0/dmac_write_state]
connect_bd_net [get_bd_pins rx_fifo_write_0/data_write_state] [get_bd_pins adc_data_ila/probe13]
connect_bd_net [get_bd_pins rx_fifo_write_0/fifo_din] [get_bd_pins fifo_generator_0/din] [get_bd_pins adc_data_ila/probe15]
connect_bd_net [get_bd_pins rx_fifo_write_0/fifo_srst] [get_bd_pins fifo_generator_0/srst] [get_bd_pins adc_data_ila/probe4]
connect_bd_net [get_bd_pins rx_fifo_write_0/fifo_wr_en] [get_bd_pins fifo_generator_0/wr_en] [get_bd_pins adc_data_ila/probe14]
connect_bd_net [get_bd_pins rx_fifo_write_0/wr_data_buf] [get_bd_pins adc_data_ila/probe12]
connect_bd_net [get_bd_pins tungsten_mpsoc/emio_gpio_o] [get_bd_ports emio_gpio_o]
connect_bd_net [get_bd_pins tungsten_mpsoc/emio_gpio_t] [get_bd_ports emio_gpio_t]
connect_bd_net [get_bd_pins tungsten_mpsoc/emio_spi0_m_o] [get_bd_ports emio_spi0_m_o]
connect_bd_net [get_bd_pins tungsten_mpsoc/emio_spi0_sclk_o] [get_bd_ports emio_spi0_sclk_o]
connect_bd_net [get_bd_pins tungsten_mpsoc/emio_spi0_ss1_o_n] [get_bd_ports emio_spi0_ss1_o_n]
connect_bd_net [get_bd_pins tungsten_mpsoc/emio_spi0_ss2_o_n] [get_bd_ports emio_spi0_ss2_o_n]
connect_bd_net [get_bd_pins tungsten_mpsoc/emio_spi0_ss_o_n] [get_bd_ports emio_spi0_ss0_o_n]
connect_bd_net [get_bd_pins tungsten_mpsoc/pl_clk0] \
  [get_bd_ports pl_clk_100MHz] [get_bd_pins tungsten_mpsoc/maxihpm0_lpd_aclk] [get_bd_pins tungsten_mpsoc_axi_periph/ACLK] \
  [get_bd_pins tungsten_mpsoc_axi_periph/M00_ACLK] [get_bd_pins tungsten_mpsoc_axi_periph/S00_ACLK] \
  [get_bd_pins rst_tungsten_mpsoc_100M/slowest_sync_clk] [get_bd_pins rx_channel_regs_0/aclk]
connect_bd_net [get_bd_pins tungsten_mpsoc/pl_clk1] \
  [get_bd_pins fifo_generator_0/rd_clk] [get_bd_pins tungsten_mpsoc/saxihp0_fpd_aclk] \
  [get_bd_pins hpm_channel_splitter_0/aclk] [get_bd_pins ila_rx_dmac/clk] [get_bd_pins proc_sys_reset_200M/slowest_sync_clk] \
  [get_bd_pins rx_dmac_0/aclk]
connect_bd_net [get_bd_pins tungsten_mpsoc/pl_resetn0] \
  [get_bd_ports pl_reset_b] [get_bd_pins rst_tungsten_mpsoc_100M/ext_reset_in] [get_bd_pins proc_sys_reset_200M/ext_reset_in]
connect_bd_net [get_bd_pins xlslice_0/Dout] [get_bd_pins adc_data_ila/probe0]
connect_bd_net [get_bd_pins xlslice_1/Dout] [get_bd_pins adc_data_ila/probe2]

# ---- address map ----
assign_bd_address -offset 0x000000000000 -range 2G -target_address_space [get_bd_addr_spaces hpm_channel_splitter_0/hpm] [get_bd_addr_segs tungsten_mpsoc/SAXIGP2/HP0_DDR_LOW]
assign_bd_address -offset 0x0000C0000000 -range 512M -target_address_space [get_bd_addr_spaces hpm_channel_splitter_0/hpm] [get_bd_addr_segs tungsten_mpsoc/SAXIGP2/HP0_QSPI]
assign_bd_address -offset 0x0000FF000000 -range 16M -target_address_space [get_bd_addr_spaces hpm_channel_splitter_0/hpm] [get_bd_addr_segs tungsten_mpsoc/SAXIGP2/HP0_LPS_OCM]
assign_bd_address -offset 0x000800000000 -range 2G -target_address_space [get_bd_addr_spaces hpm_channel_splitter_0/hpm] [get_bd_addr_segs tungsten_mpsoc/SAXIGP2/HP0_DDR_HIGH]
assign_bd_address -offset 0x000000000000 -range 256T -target_address_space [get_bd_addr_spaces rx_dmac_0/m_axi] [get_bd_addr_segs hpm_channel_splitter_0/rx_channel/reg0]
assign_bd_address -offset 0x0080000000 -range 64K -target_address_space [get_bd_addr_spaces tungsten_mpsoc/Data] [get_bd_addr_segs rx_channel_regs_0/s_axi/reg0]

validate_bd_design
save_bd_design
